# Altium project LCD_board.PrjPCB
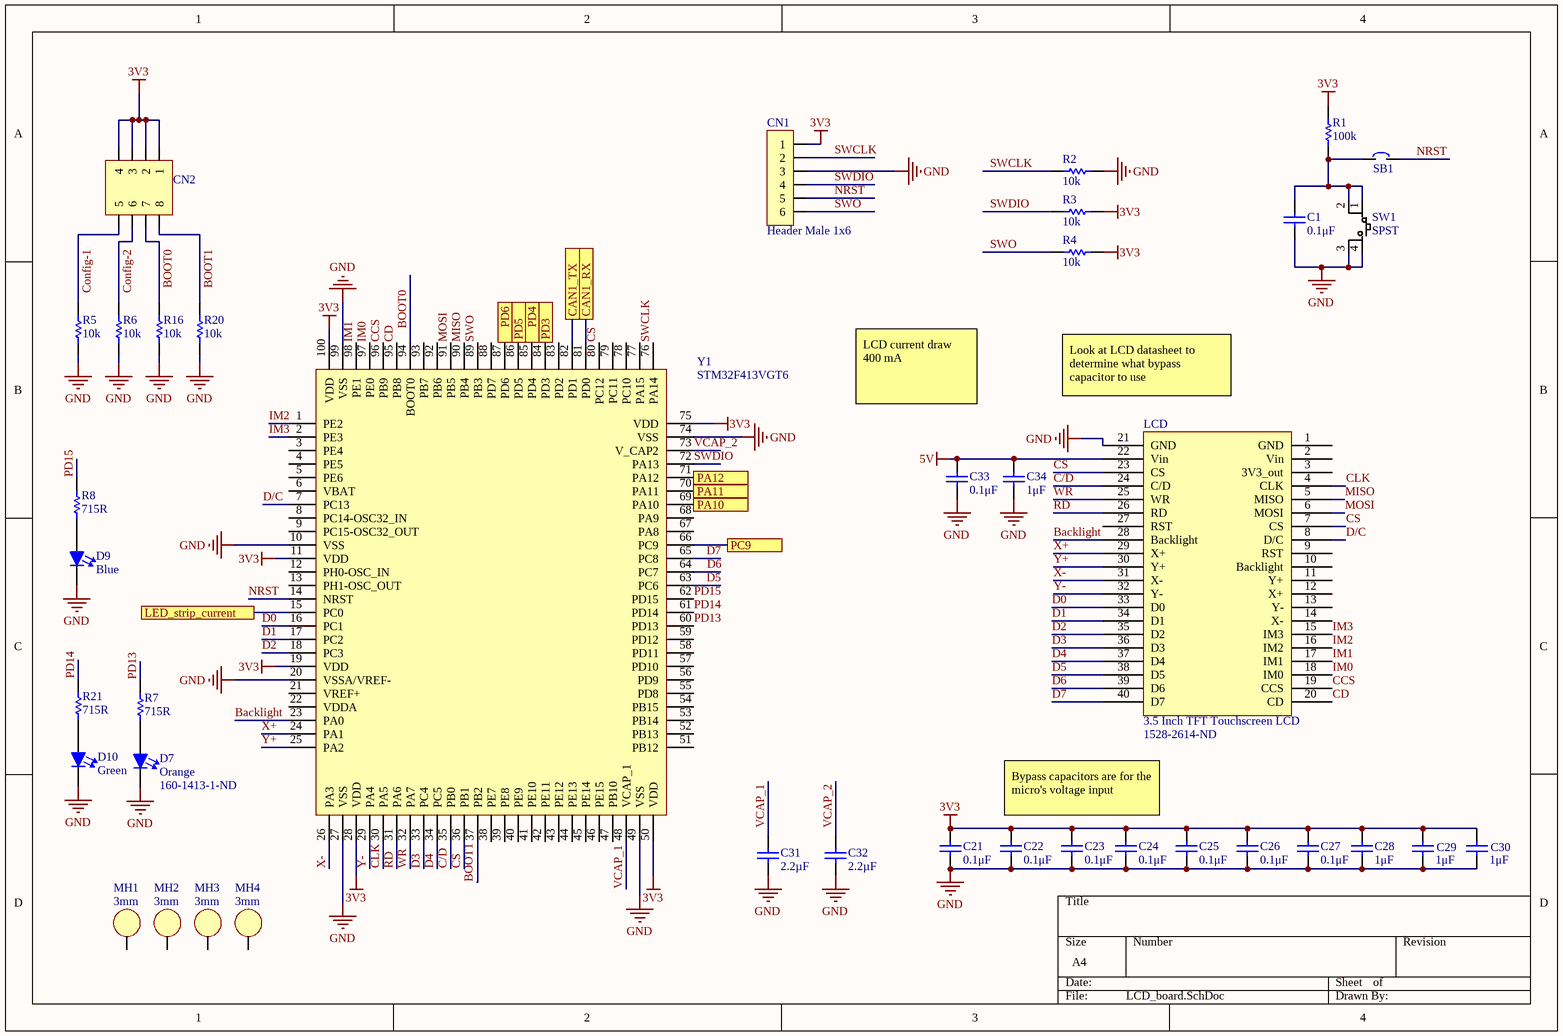
[diagram p0: LCD_board.SchDoc]
5 sheets, 101 parts. Net scope: flat (ports and power ports of the same name join across sheets).
Board file: lcd_board_1.PcbDoc
Sheets:
  LCD_board.SchDoc
  USB.SchDoc
  power.SchDoc
  LED strip.SchDoc
  CAN.SchDoc

## Sheet LCD_board.SchDoc
size A4

### Parts
C1  0.1μF  [CAPC1608N(0603")]
C21  0.1μF  [CAPC1608N(0603")]
C22  0.1μF  [CAPC1608N(0603")]
C23  0.1μF  [CAPC1608N(0603")]
C24  0.1μF  [CAPC1608N(0603")]
C25  0.1μF  [CAPC1608N(0603")]
C26  0.1μF  [CAPC1608N(0603")]
C27  0.1μF  [CAPC1608N(0603")]
C28  1μF  [CAPC1608N(0603")]
C29  1μF  [CAPC1608N(0603")]
C30  1μF  [CAPC1608N(0603")]
C31  2.2µF  [CAPC1608N(0603")]
C32  2.2µF  [CAPC1608N(0603")]
C33  0.1μF  [CAPC1608N(0603")]
C34  1μF  [CAPC1608N(0603")]
CN1  Header Male 1x6  [Header, Male, 1X6]
CN2  Header, Male, 2x4, Pitch: 0.1" (2.54mm), THT  [Header, Male, 2x4, Pitch: 0.1" (2.54mm),THT]  (value not drawn)
D7  Orange  Supplier Part Number 1: 160-1413-1-ND  [LED0805]
D9  Blue  [LED0805]
D10  Green  [LED0805]
LCD  3.5 Inch TFT Touchscreen LCD  Supplier Part Number 1: 1528-2614-ND  [LCD_touchscreen_tft]
MH1  3mm  [Mount-Hole_3mm]
MH2  3mm  [Mount-Hole_3mm]
MH3  3mm  [Mount-Hole_3mm]
MH4  3mm  [Mount-Hole_3mm]
R1  100k  [RESC1608N(0603")]
R2  10k  [RESC1608N(0603")]
R3  10k  [RESC1608N(0603")]
R4  10k  [RESC1608N(0603")]
R5  10k  [RESC1608N(0603")]
R6  10k  [RESC1608N(0603")]
R7  715R  [RESC1608N(0603")]
R8  715R  [RESC1608N(0603")]
R16  10k  [RESC1608N(0603")]
R20  10k  [RESC1608N(0603")]
R21  715R  [RESC1608N(0603")]
SB1  Solder Bridge  [Solder Bridge]  (value not drawn)
SW1  SPST  [4-SPST-NO]
Y1  STM32F413VGT6  [STM-LQFP100_M]

### Ports
CAN1_RX, CAN1_TX, LED_strip_current, PA10, PA11, PA12, PC9, PD3, PD4, PD5, PD6

### Nets
3V3: C21.2(Cathode) C22.2(Cathode) C23.2(Cathode) C24.2(Cathode) C25.2(Cathode) C26.2(Cathode) C27.2(Cathode) C28.2(Cathode) C29.2(Cathode) C30.2(Cathode) CN1.1 CN2.1 CN2.2 CN2.3 CN2.4 R1.2 R3.2 R4.2 Y1.11(VDD) Y1.19(VDD) Y1.28(VDD) Y1.50(VDD) Y1.75(VDD) Y1.100(VDD)
5V: C33.2(Cathode) C34.2(Cathode) LCD.22(Vin)
GND: C1.1(Anode) C21.1(Anode) C22.1(Anode) C23.1(Anode) C24.1(Anode) C25.1(Anode) C26.1(Anode) C27.1(Anode) C28.1(Anode) C29.1(Anode) C30.1(Anode) C31.1(Anode) C32.1(Anode) C33.1(Anode) C34.1(Anode) CN1.3 D7.1(Cathode) D9.1(Cathode) D10.1(Cathode) LCD.21(GND) R2.1 R5.1 R6.1 R16.1 R20.1 SW1.3 SW1.4 Y1.10(VSS) Y1.20(VSSA/VREF-) Y1.27(VSS) Y1.49(VSS) Y1.74(VSS) Y1.99(VSS)
Backlight: LCD.28(Backlight) Y1.23(PA0)
BOOT0: CN2.7 R16.2 Y1.94(BOOT0)
BOOT1: CN2.8 R20.2 Y1.37(PB2)
C/D: LCD.24(C/D) Y1.35(PB0)
CCS: LCD.19(CCS) Y1.96(PB9)
CD: LCD.20(CD) Y1.95(PB8)
CLK: LCD.4(CLK) Y1.30(PA5)
Config-1: CN2.5 R5.2
Config-2: CN2.6 R6.2
CS: LCD.7(CS) LCD.23(CS) Y1.36(PB1) Y1.80(PC12)
D0: LCD.33(D0) Y1.16(PC1)
D1: LCD.34(D1) Y1.17(PC2)
D2: LCD.35(D2) Y1.18(PC3)
D3: LCD.36(D3) Y1.33(PC4)
D4: LCD.37(D4) Y1.34(PC5)
D5: LCD.38(D5) Y1.63(PC6)
D6: LCD.39(D6) Y1.64(PC7)
D7: LCD.40(D7) Y1.65(PC8)
D/C: LCD.8(D/C) Y1.7(PC13)
IM0: LCD.18(IM0) Y1.97(PE0)
IM1: LCD.17(IM1) Y1.98(PE1)
IM2: LCD.16(IM2) Y1.1(PE2)
IM3: LCD.15(IM3) Y1.2(PE3)
MISO: LCD.5(MISO) Y1.90(PB4)
MOSI: LCD.6(MOSI) Y1.91(PB5)
NRST: CN1.5 SB1.2 Y1.14(NRST)
PD13: R7.2 Y1.60(PD13)
PD14: R21.2 Y1.61(PD14)
PD15: R8.2 Y1.62(PD15)
RD: LCD.26(RD) Y1.31(PA6)
SWCLK: CN1.2 R2.2 Y1.76(PA14)
SWDIO: CN1.4 R3.1 Y1.72(PA13)
SWO: CN1.6 R4.1 Y1.89(PB3)
USB_Data_N: Y1.70(PA11) ; port PA11
USB_Data_P: Y1.71(PA12) ; port PA12
VCAP_1: C31.2(Cathode) Y1.48(VCAP_1)
VCAP_2: C32.2(Cathode) Y1.73(V_CAP2)
WR: LCD.25(WR) Y1.32(PA7)
X+: LCD.29(X+) Y1.24(PA1)
X-: LCD.31(X-) Y1.26(PA3)
Y+: LCD.30(Y+) Y1.25(PA2)
Y-: LCD.32(Y-) Y1.29(PA4)
NetC1_2: C1.2(Cathode) R1.1 SB1.1 SW1.1 SW1.2
NetD7_2: D7.2(Anode) R7.1
NetD9_2: D9.2(Anode) R8.1
NetD10_2: D10.2(Anode) R21.1
NetP2_4: Y1.69(PA10) ; port PA10
NetR29_2: Y1.15(PC0) ; port LED_strip_current
NetU3_1: Y1.87(PD6) ; port PD6
NetU3_2: Y1.84(PD3) ; port PD3
NetU3_4: Y1.86(PD5) ; port PD5
NetU3_6: Y1.85(PD4) ; port PD4
NetU4_3: Y1.66(PC9) ; port PC9
NetU6_1: Y1.81(PD0) ; port CAN1_RX
NetU6_4: Y1.82(PD1) ; port CAN1_TX

Not connected (* = marked no-connect by the designer): LCD 1(GND) 2(Vin) 3(3V3_out) 9(RST) 10(Backlight) 11(Y+) 12(X+) 13(Y-) 14(X-) 27(RST); MH1 1; MH2 1; MH3 1; MH4 1; Y1 3(PE4) 4(PE5) 5(PE6) 6(VBAT) 8(PC14-OSC32_IN) 9(PC15-OSC32_OUT) 12(PH0-OSC_IN) 13(PH1-OSC_OUT) 21(VREF+) 22(VDDA) 38(PE7) 39(PE8) 40(PE9) 41(PE10) 42(PE11) 43(PE12) 44(PE13) 45(PE14) 46(PE15) 47(PB10) 51(PB12) 52(PB13) 53(PB14) 54(PB15) 55(PD8) 56(PD9) 57(PD10) 58(PD11) 59(PD12) 67(PA8) 68(PA9) 77(PA15) 78(PC10) 79(PC11) 83(PD2) 88(PD7) 92(PB6) 93(PB7)

### Notes on the sheet
- LCD current draw 400 mA
- (near LCD) Look at LCD datasheet to determine what bypass capacitor to use
- Bypass capacitors are for the micro's voltage input

### Library data of the parts
C1 C21-C27 C33 = 0.1uF 100V 0603 SMD, Ceramic: Capacitor, Ceramic, 100V, +/- 10%, 0603 SMD, X7R; MFG: TDK; MFG#: CGA3E3X7S2A104K080AB; Published: 16-04-26; Publisher: AUVic; PackageDescription: Chip Capacitor; Value: 0.1μF; Created By: Ashwin Sira; Supplier 1: Digi-Key; Supplier Part Number 1: 445-6938-1-ND
C28-C30 C34 = 1uF 25V 0603 SMD, Ceramic: Capacitor, Ceramic, 25V, +/- 10%, 0603 SMD, X5R; MFG: Murata-Electronics-North-America; MFG#: GRM188R61E105KA12D; Published: 16-06-27; Publisher: AUVic; PackageDescription: Chip Capacitor; Value: 1μF; Created By: Andy Bates; Supplier 1: Digi-Key; Supplier Part Number 1: 490-3897-1-ND
C31 C32 = 2.2uF, 50V, 0603 SMD, X5R, Ceramic: Capacitor, Ceramic, 50V, 10%, 0603 SMD, X5R; Date Created: *; PackageDescription: Chip Capacitor; Value: 2.2µF; Made By: *; Publisher: AUVic; Supplier 1: Digi-Key; Supplier Part Number 1: 490-10733-1-ND
CN1 = Header, Male, 1x6: 1x6, Pads Pitch: 0.1" (2.54mm), Through hole; Made Bates: Andy Bates; Supplier 1: Digikey; Supplier 1 Part Number: 952-2270-ND
D7 = LED, 0805 (2012), Orange, Clear: Colour: Orange; Created By: Robert Keen; ComponentLink1Description: Digikey; ComponentLink1URL: https://www.digikey.ca/product-detail/en/lite-on-inc/LTST-C170KFKT/160-1413-1-ND/386774; Supplier 1: Digi-Key
D9 = LED, 0805 (2012), Blue, Clear: Colour: Red; Created By: Ashwin Sira; Supplier 1: Digi-Key; Supplier Part Number 1: 732-4982-1-ND
D10 = LED, 0805 (2012), Green, Clear: Colour: Green; Created By: Andy Bates; Supplier 1: Digi-Key; Supplier Part Number 1: 475-1410-1-ND
LCD = Adafruit ILI9341: 3.2" TFT LCD with Touchscreen Breakout Board w/MicroSD Socket; ComponentLink1Description: Adafruit; ComponentLink1URL: https://www.adafruit.com/product/1743; ComponentLink2Description: Datasheet; ComponentLink2URL: https://cdn-shop.adafruit.com/datasheets/ILI9341.pdf; ComponentLink3Description: Raw LCD Datasheet; ComponentLink3URL: https://cdn-shop.adafruit.com/datasheets/MI0283QT-11+V1.1.PDF; ComponentLink4Description: DigiKey; ComponentLink4URL: https://www.digikey.ca/products/en/optoelectronics/display-modules-lcd-oled-graphic/107?k=&pkeyword=&pv652=165&FV=ffe0006b%2Cfffc05f8&quantity=0&ColumnSort=0&page=1&pageSize=25; ComponentLink5Description: Adafruit Guide; ComponentLink5URL: https://cdn-learn.adafruit.com/downloads/pdf/adafruit-2-dot-8-color-tft-touchscreen-breakout-v2.pdf; Supplier 1: Digi-Key; Supplier 2: Digi-Key; Supplier Part Number 2: S7053-ND
MH1-MH4 = Mount_Hole_3mm
R1 = 100kR, 1%, 1/10W, 0603 SMD: Made By: Andy Bates; Owned By: AUVic; Created On: 14-06-30; Last Edited: 14-06-30; Value: 100k; Supplier 1: Digi-Key; Supplier Part Number 1: 311-100KGRCT-ND
R2-R6 R16 R20 = 10kR, 1%, 1/10W, 0603 SMD: Made By: Ashwin Sira; Owned By: AUVic; Created On: 14-05-31; Last Edited: 14-05-31; Supplier 1: Digi-Key; Supplier Part Number 1: 311-10.0KHRCT-ND; Value: 10k
R7 R8 R21 = 715R, 1%, 1/10W, 0603, SMD: Created By: Ashwin Sira; Publisher: AUVic; Date Created: 2016-06-10; Value: 715R; Supplier 1: Digi-Key; Supplier Part Number 1: 541-715HCT-ND
SB1 = Solder Bridge: Made By: Andy Bates; Created On: 2016/09/08
SW1 = 4 pin Tacitle Switch: Made By: Andy Bates; Button Type: Single Pole Single Throw; Supplier 1: Digikey; Supplier 1 Part Number: CKN9084CT-ND
Y1 = STM32F413VGT6: ARM Cortex-M4 32-bit MCU, 180 MHz, 320 KB Internal Rap, 81 I/O, 100-pin LQFP, -40 to 85 degC, Tray; Core Size: 32-bit; Supplier 1: Digi-Key; Supplier: Digikey; Supplier Part Number 1: 497-17009-ND
CN2 = Header, Male, 2x4, Pitch: 0.1" (2.54mm), THT: Publisher: AUVic; Date Published: 2017-09-13; Last Updated: *; Reviewed By: *; Created By: Andy Bates

## Sheet USB.SchDoc
size A4
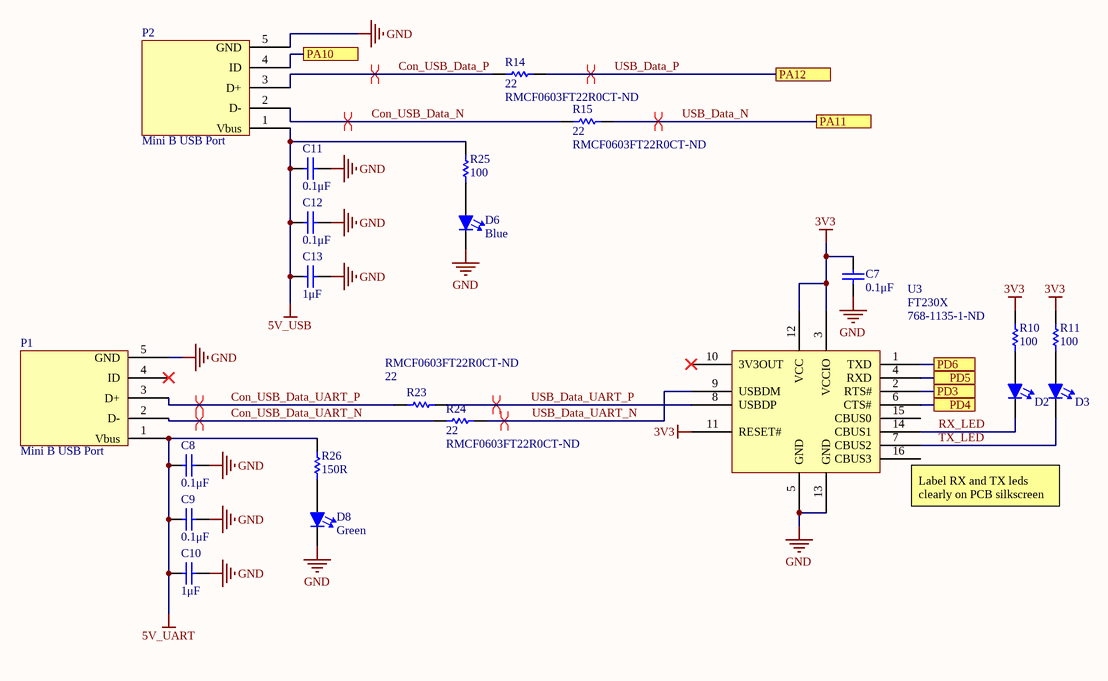
[diagram p1: USB.SchDoc]

### Parts
C7  0.1μF  [CAPC1608N(0603")]
C8  0.1μF  [CAPC1608N(0603")]
C9  0.1μF  [CAPC1608N(0603")]
C10  1μF  [CAPC1608N(0603")]
C11  0.1μF  [CAPC1608N(0603")]
C12  0.1μF  [CAPC1608N(0603")]
C13  1μF  [CAPC1608N(0603")]
D2  Red  [LED0805]  (value not drawn)
D3  Red  [LED0805]  (value not drawn)
D6  Blue  [LED0805]
D8  Green  [LED0805]
P1  Mini B USB Port  [Mini B USB Footprint]
P2  Mini B USB Port  [Mini B USB Footprint]
R10  100  [RESC1608N(0603")]
R11  100  [RESC1608N(0603")]
R14  22  Supplier Part Number 1: RMCF0603FT22R0CT-ND  [RESC1608N(0603")]
R15  22  Supplier Part Number 1: RMCF0603FT22R0CT-ND  [RESC1608N(0603")]
R23  22  Supplier Part Number 1: RMCF0603FT22R0CT-ND  [RESC1608N(0603")]
R24  22  Supplier Part Number 1: RMCF0603FT22R0CT-ND  [RESC1608N(0603")]
R25  100  [RESC1608N(0603")]
R26  150R  [RESC1608N(0603")]
U3  FT230X  Supplier Part Number 1: 768-1135-1-ND  [SSOP16]

### Ports
PA10, PA11, PA12, PD3, PD4, PD5, PD6

### Nets
3V3: C7.2(Cathode) R10.2 R11.2 U3.3(VCCIO) U3.11(RESET#) U3.12(VCC)
5V_UART: C8.2(Cathode) C9.2(Cathode) C10.2(Cathode) P1.1(Vbus) R26.2
5V_USB: C11.2(Cathode) C12.2(Cathode) C13.2(Cathode) P2.1(Vbus) R25.2
GND: C7.1(Anode) C8.1(Anode) C9.1(Anode) C10.1(Anode) C11.1(Anode) C12.1(Anode) C13.1(Anode) D6.1(Cathode) D8.1(Cathode) P1.5(GND) P2.5(GND) U3.5(GND) U3.13(GND)
Con_USB_Data_N: P2.2(D-) R15.1
Con_USB_Data_P: P2.3(D+) R14.1
Con_USB_Data_UART_N: P1.2(D-) R24.1
Con_USB_Data_UART_P: P1.3(D+) R23.1
RX_LED: D2.1(Cathode) U3.14(CBUS1)
TX_LED: D3.1(Cathode) U3.7(CBUS2)
USB_Data_N: R15.2 ; port PA11
USB_Data_P: R14.2 ; port PA12
USB_Data_UART_N: R24.2 U3.9(USBDM)
USB_Data_UART_P: R23.2 U3.8(USBDP)
NetD2_2: D2.2(Anode) R10.1
NetD3_2: D3.2(Anode) R11.1
NetD6_2: D6.2(Anode) R25.1
NetD8_2: D8.2(Anode) R26.1
NetP2_4: P2.4(ID) ; port PA10
NetU3_1: U3.1(TXD) ; port PD6
NetU3_2: U3.2(RTS#) ; port PD3
NetU3_4: U3.4(RXD) ; port PD5
NetU3_6: U3.6(CTS#) ; port PD4

Not connected (* = marked no-connect by the designer): P1 4(ID)*; U3 10(3V3OUT)* 15(CBUS0) 16(CBUS3)

### Layout directives
differential pair: Con_USB_Data_N, Con_USB_Data_P, Con_USB_Data_UART_N, Con_USB_Data_UART_P, USB_Data_N, USB_Data_P, USB_Data_UART_N, USB_Data_UART_P

### Notes on the sheet
- (near U3) Label RX and TX leds clearly on PCB silkscreen

### Library data of the parts
C7-C9 C11 C12 = 0.1uF 100V 0603 SMD, Ceramic: as C1 on sheet LCD_board; Published: 16-04-26; Publisher: AUVic; PackageDescription: Chip Capacitor; Value: 0.1μF; Created By: Ashwin Sira; Supplier 1: Digi-Key; Supplier Part Number 1: 445-6938-1-ND
C10 C13 = 1uF 25V 0603 SMD, Ceramic: as C28 on sheet LCD_board; Published: 16-06-27; Publisher: AUVic; PackageDescription: Chip Capacitor; Value: 1μF; Created By: Andy Bates; Supplier 1: Digi-Key; Supplier Part Number 1: 490-3897-1-ND
D2 D3 = LED, 0805 (2012), Red, Clear: Supplier 1: Digi-Key; Supplier Part Number 1: 732-4984-1-ND; Colour: Red; Created By: Ashwin Sira
D6 = LED, 0805 (2012), Blue, Clear: Colour: Red; Created By: Ashwin Sira; Supplier 1: Digi-Key; Supplier Part Number 1: 732-4982-1-ND
D8 = LED, 0805 (2012), Green, Clear: Colour: Green; Created By: Andy Bates; Supplier 1: Digi-Key; Supplier Part Number 1: 475-1410-1-ND
P1 P2 = Mini B USB Port: Mini B USB Port - Female; Created by: Gabriel Green; Created on: July 5, 2017; Supplier 1: Digi-Key; Supplier Part Number 1: 151-1206-1-ND
R10 R11 R25 = 100R, 1%, 1/10W, 0603 SMD: Made By: Andy Bates; Owned By: AUVic; Created On: 16-09-10; Last Edited: 16-09-10; Value: 100; Supplier 1: Digi-Key; Supplier Part Number 1: 311-100HRCT-ND
R14 R15 R23 R24 = 22 Ohm, 1%, 1/10W , 0603, SMD: Created By: Robert Keen; Publisher: AUVic; Date Created: 2018-07-17; Value: 22; ComponentLink1Description: Digikey; ComponentLink1URL: https://www.digikey.ca/product-detail/en/stackpole-electronics-inc/RMCF0603FT22R0/RMCF0603FT22R0CT-ND/1942946; Supplier 1: Digi-Key
R26 = 150R, 1%, 1/10W, 0603, SMD: RES SMD 150 OHM 1% 1/10W 0603; Created By: Robert Keen; Publisher: AUVic; Date Created: 2018-08-15; Value: 150R; Supplier 1: Digi-Key; Supplier Part Number 1: P150HCT-ND; ComponentLink1Description: Digikey; ComponentLink1URL: https://www.digikey.ca/product-detail/en/panasonic-electronic-components/ERJ-3EKF1500V/P150HCT-ND/198177
U3 = FTDI - USB to UART: Supplier 1: Digi-Key; Created by: Gabriel Green; Created on: July 5th, 2017

## Sheet power.SchDoc
size A4
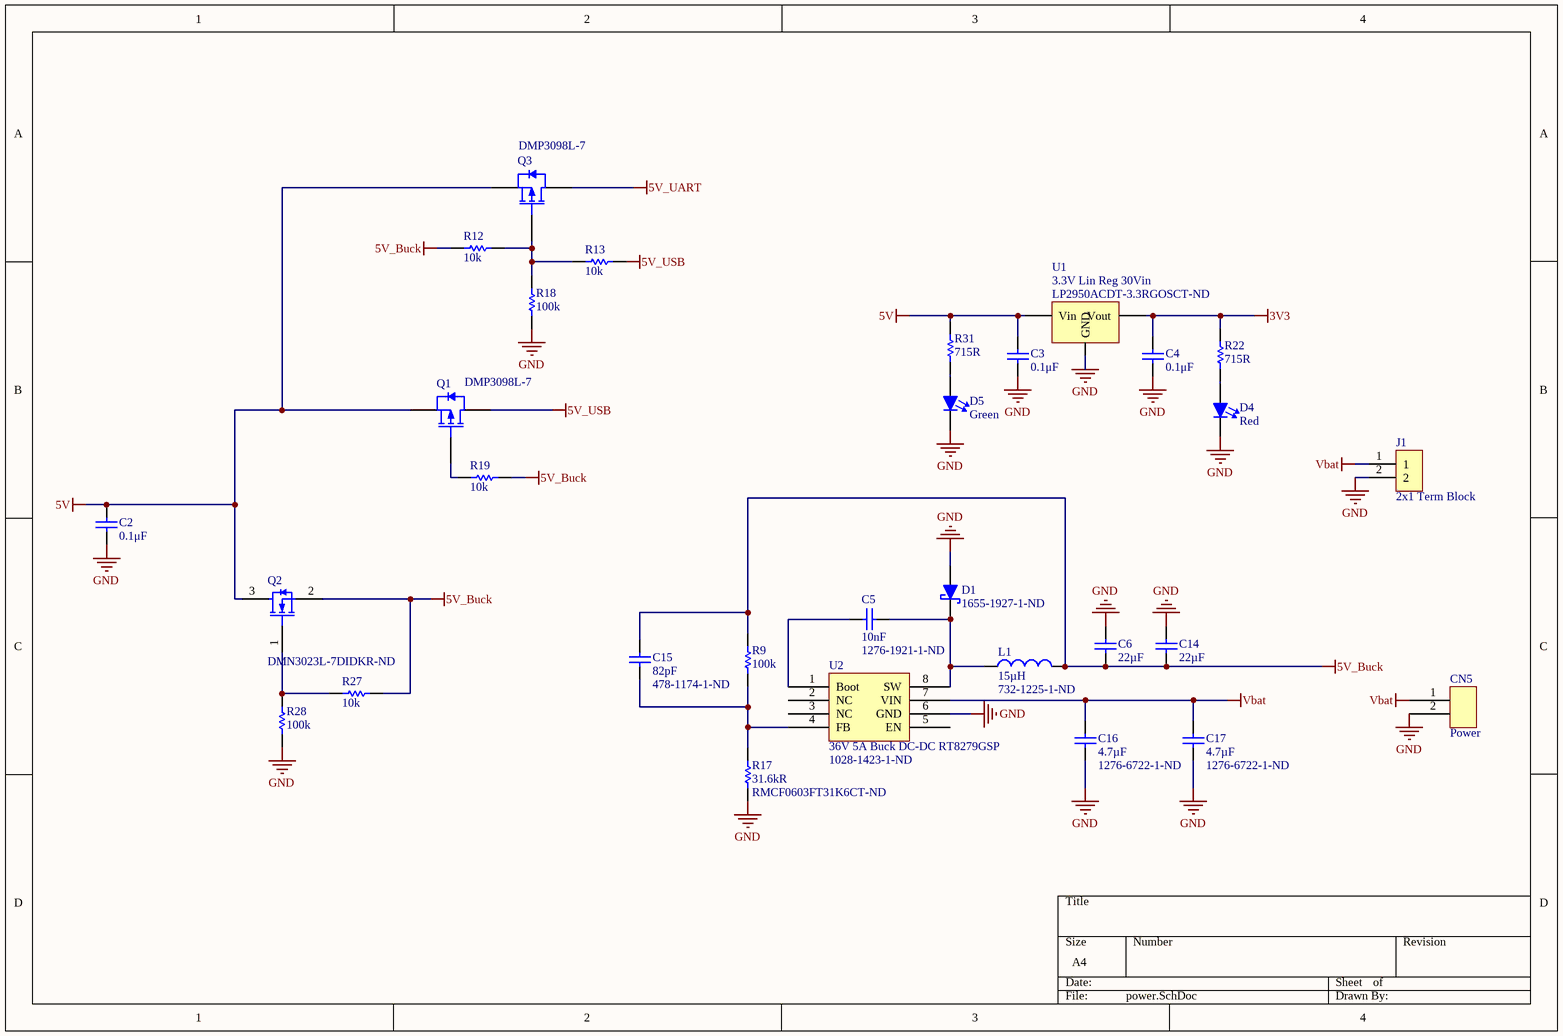
[diagram p2: power.SchDoc]

### Parts
C2  0.1μF  [CAPC1608N(0603")]
C3  0.1μF  [CAPC1608N(0603")]
C4  0.1μF  [CAPC1608N(0603")]
C5  10nF  Supplier Part Number 1: 1276-1921-1-ND  [CAPC1608N(0603")]
C6  22µF  [CAPC2012N(0805")]
C14  22µF  [CAPC2012N(0805")]
C15  82pF  Supplier Part Number 1: 478-1174-1-ND  [CAPC1608N(0603")]
C16  4.7µF  Supplier Part Number 1: 1276-6722-1-ND  [CAPC2012N(0805")]
C17  4.7µF  Supplier Part Number 1: 1276-6722-1-ND  [CAPC2012N(0805")]
CN5  Power  [2X1 Power Connector 90 degrees]
D1  Supplier Part Number 1: 1655-1927-1-ND  [SOD-123F]  (hidden comment: DSS14UTR)
D4  Red  [LED0805]
D5  Green  [LED0805]
J1  2x1 Term Block  [2X1 Terminal Blocks]
L1  15µH  Supplier Part Number 1: 732-1225-1-ND  [WE-PD-XL]
Q1  DMP3098L-7  [DIOD-SOT23-3_V]
Q2  Supplier Part Number 1: DMN3023L-7DIDKR-ND  [SOT-23]  (hidden comment: MOSFET N-Channel, 30V, 6.2A,)
Q3  DMP3098L-7  [DIOD-SOT23-3_V]
R9  100k  [RESC1608N(0603")]
R12  10k  [RESC1608N(0603")]
R13  10k  [RESC1608N(0603")]
R17  31.6kR  Supplier Part Number 1: RMCF0603FT31K6CT-ND  [RESC1608N(0603")]
R18  100k  [RESC1608N(0603")]
R19  10k  [RESC1608N(0603")]
R22  715R  [RESC1608N(0603")]
R27  10k  [RESC1608N(0603")]
R28  100k  [RESC1608N(0603")]
R31  715R  [RESC1608N(0603")]
U1  3.3V Lin Reg 30Vin  Supplier Part Number 1: LP2950ACDT-3.3RGOSCT-ND  [T0-252]
U2  36V 5A Buck DC-DC RT8279GSP  Supplier Part Number 3: 1028-1423-1-ND  [8-SOP-EP]

### Nets
3V3: C4.2(Cathode) R22.2 U1.3(Vout)
5V: C2.2(Cathode) C3.2(Cathode) Q1.2(S) Q2.3(Drain) Q3.2(S) R31.2 U1.2(Vin)
5V_Buck: C6.1(Anode) C14.1(Anode) C15.2 L1.2 Q2.2(Source) R9.2 R12.1 R19.2 R27.2
5V_UART: Q3.3(D)
5V_USB: Q1.3(D) R13.2
GND: C2.1(Anode) C3.1(Anode) C4.1(Anode) C6.2(Cathode) C14.2(Cathode) C16.2(Cathode) C17.2(Cathode) CN5.2 D1.A(Anode) D4.1(Cathode) D5.1(Cathode) J1.2 R17.1 R18.1 R28.1 U1.1(GND) U2.6(GND)
Vbat: C16.1(Anode) C17.1(Anode) CN5.1 J1.1 U2.7(VIN)
NetC5_1: C5.1(Anode) D1.K(Cathode) L1.1 U2.8(SW)
NetC5_2: C5.2(Cathode) U2.1(Boot)
NetC15_1: C15.1 R9.1 R17.2 U2.4(FB)
NetD4_2: D4.2(Anode) R22.1
NetD5_2: D5.2(Anode) R31.1
NetQ1_1: Q1.1(G) R19.1
NetQ2_1: Q2.1(Gate) R27.1 R28.2
NetQ3_1: Q3.1(G) R12.2 R13.1 R18.2

Not connected (* = marked no-connect by the designer): U2 2(NC) 3(NC) 5(EN)

### Library data of the parts
C2-C4 = 0.1uF 100V 0603 SMD, Ceramic: as C1 on sheet LCD_board; Published: 16-04-26; Publisher: AUVic; PackageDescription: Chip Capacitor; Value: 0.1μF; Created By: Ashwin Sira; Supplier 1: Digi-Key; Supplier Part Number 1: 445-6938-1-ND
C5 = 10 nF, 50V 0603 SMD, Ceramic: Capacitor, Ceramic, 50V, +/- 10%, 0603 SMD; MFG: Samsung; MFG#: GRM188R61A475KE15D; Published: 16-06-23; Publisher: AUVic; PackageDescription: Chip Capacitor; Value: 10nF; Created By: Gabriel; Supplier 1: Digi-Key
C6 C14 = 22uF 35V 0805 SMD, Ceramic: Capacitor, Ceramic, 35V, +/- 20%, 0805 SMD, X5R; Published: 14-06-01; Publisher: AUVic; PackageDescription: Chip Capacitor; Value: 22µF; Supplier 1: Digi-Key; Supplier Part Number 1: 445-14428-1-ND
C15 = 82pF 50V 0603 SMD, Ceramic: 82pF 50V Ceramic Capacitor C0G, NP0 0603; Value: 82pF; Created By: Robert Keen; Created On: 2018-07-18; ComponentLink1Description: Digikey; ComponentLink1URL: https://www.digikey.ca/product-detail/en/avx-corporation/06035A820JAT2A/478-1174-1-ND/564206; Supplier 1: Digi-Key
C16 C17 = 4.7uF 35V 0805 SMD, Ceramic: Capacitor, Ceramic, 35V, +/- 10%, 0805 SMD, X5R; Made By: Andy Bates; Published: 16-11-12; Publisher: AUVic; PackageDescription: Chip Capacitor; Value: 4.7µF; Supplier 1: Digi-Key
CN5 = 2x1, Male header, Right Angle, Latch holder: Connector Header Through Hole, Right Angle 2 position 0.312" (7.92mm); Made by: Robert Keen; ComponentLink1Description: Digikey (male); ComponentLink1URL: https://www.digikey.ca/product-detail/en/hirose-electric-co-ltd/DF22R-2P-7.92DS-05/H10706-ND/1025057; ComponentLink2Description: Digikey (female); ComponentLink2URL: https://www.digikey.ca/product-detail/en/hirose-electric-co-ltd/DF22R-2S-7.92C-28/H1615-ND/510248; ComponentLink3Description: Digikey (crimp); ComponentLink3URL: https://www.digikey.ca/product-detail/en/hirose-electric-co-ltd/DF22-1416SCF/H2788CT-ND/365031; Made on: 2018-08-16; Supplier 3: Digi-Key; Supplier Part Number 1: H10706-ND; Supplier Part Number 2: H1615-ND; Supplier Part Number 3: H2788CT-ND; Supplier 2: Digi-Key; Supplier 1: Digi-Key
D1 = DSS14UTR: Diode, Schottky, 40V, 1A; Created By: Robert Keen; Publisher: AUVic; Date Created: 2018-07-11; ComponentLink1Description: Digikey; ComponentLink1URL: https://www.digikey.ca/product-detail/en/smc-diode-solutions/DSS14UTR/1655-1927-1-ND/8341869; Supplier 1: Digi-Key
D4 = LED, 0805 (2012), Red, Clear: Supplier 1: Digi-Key; Supplier Part Number 1: 732-4984-1-ND; Colour: Red; Created By: Ashwin Sira
D5 = LED, 0805 (2012), Green, Clear: Colour: Green; Created By: Andy Bates; Supplier 1: Digi-Key; Supplier Part Number 1: 475-1410-1-ND
J1 = 2x1 Terminal Block: Made by: Andy Bates; Supplier 1: Digikey; Supplier Part Number 1: ED2740-ND
L1 = 15µH 5A Inductor: 15µH Shielded Wirewound Inductor 5A 27 mOhm Max Nonstandard; Created By: Robert Keen; Created On: 2018-06-13; Value: 15µH; ComponentLink1Description: Digikey; ComponentLink1URL: https://www.digikey.ca/product-detail/en/wurth-electronics-inc/744770115/732-1225-1-ND/1639286; Supplier 1: Digi-Key
Q1 Q3 = CMP-0697-00001-2: P-Channel Enhancement Mode MOSFET, -30 V VDS, -55 to 155 degC, 3-Pin SOT23, RoHS, Tape and Reel; Manufacturer: Diodes Inc; PD (TA: 25 degC)=1.08 W; VGS: +/- 20 V; VDS: -30 V; IDS (TA: 25 degC)=-3.8 A; RDS(on) (Max.) (VGS: 4.5 V)=120 mOhm; VGS(th) (Max.): -2.1 V; ComponentLink3Description: Package Specification; ComponentLink3URL: http://www.diodes.com/datasheets/ap02002.pdf; PackageDescription: 3-Pin Small Outline Transistor, Body 1.3 x 2.9 mm, Pitch 0.95 mm; PackageReference: SOT23; PartNumber: DMP3098L-7; ComponentLink1Description: Manufacturer URL; ComponentLink2Description: Datasheet; ComponentLink2URL: http://www.diodes.com/datasheets/ds31447.pdf; ComponentLink1URL: http://www.diodes.com/; DatasheetVersion: Rev. 8 - 2; Mounting Technology: Surface Mount; RoHS: TRUE; Packing: Tape and Reel; PackageVersion: Rev. 75; Operating Temperature Range: -55 to 150 degC
Q2 = MOSFET N-Channel, 30V, 6.2A,: N-Channel 30V 6.2A (Ta) 900mW (Ta) Surface Mount SOT-23; Supplier 1: Digi-Key; Created By: Poorna Chander Kalidas; ComponentLink1Description: Digi-Key; ComponentLink1URL: https://www.digikey.ca/product-detail/en/diodes-incorporated/DMN3023L-7/DMN3023L-7DICT-ND/5453155
R9 R18 R28 = 100kR, 1%, 1/10W, 0603 SMD: Made By: Andy Bates; Owned By: AUVic; Created On: 14-06-30; Last Edited: 14-06-30; Value: 100k; Supplier 1: Digi-Key; Supplier Part Number 1: 311-100KGRCT-ND
R12 R13 R19 R27 = 10kR, 1%, 1/10W, 0603 SMD: Made By: Ashwin Sira; Owned By: AUVic; Created On: 14-05-31; Last Edited: 14-05-31; Supplier 1: Digi-Key; Supplier Part Number 1: 311-10.0KHRCT-ND; Value: 10k
R17 = 31.6kR, 1%, 1/10W, 0603, SMD: Created By: Robert Keen; Date Created: 2018-07-18; Value: 31.6kR; ComponentLink1Description: Digikey; ComponentLink1URL: https://www.digikey.ca/product-detail/en/stackpole-electronics-inc/RMCF0603FT31K6/RMCF0603FT31K6CT-ND/1943089; Supplier 1: Digi-Key
R22 R31 = 715R, 1%, 1/10W, 0603, SMD: Created By: Ashwin Sira; Publisher: AUVic; Date Created: 2016-06-10; Value: 715R; Supplier 1: Digi-Key; Supplier Part Number 1: 541-715HCT-ND
U1 = 3.3V TO-252 Linear Regulator: Supplier 1: Digi-Key
U2 = 36V 5A Buck DC-DC RT8279GSP: Made by: Robert Keen; Supplier 1: Digi-Key; Made on: 2017-07-18; Supplier 2: Digi-Key; ComponentLink1Description: Digikey; ComponentLink1URL: https://www.digikey.ca/product-detail/en/richtek-usa-inc/RT8279GSP/1028-1423-1-ND/5880353; Supplier 3: Digi-Key

## Sheet LED strip.SchDoc
size A4
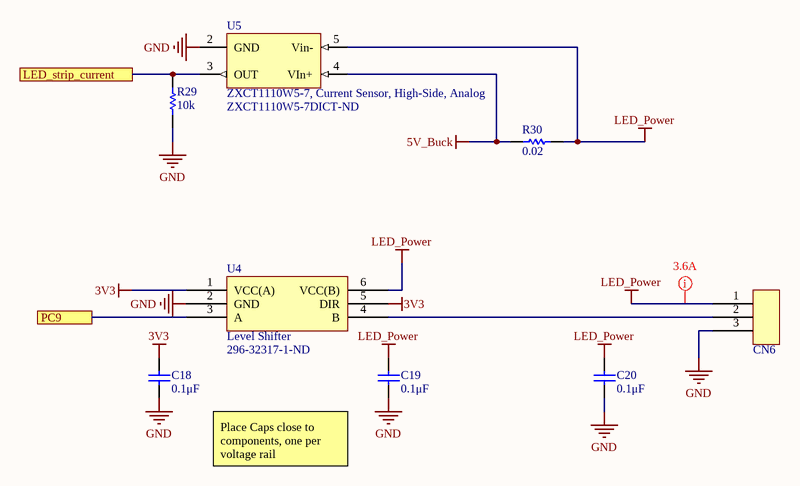
[diagram p3: LED strip.SchDoc]

### Parts
C18  0.1μF  [CAPC1608N(0603")]
C19  0.1μF  [CAPC1608N(0603")]
C20  0.1μF  [CAPC1608N(0603")]
CN6  B3PS-VH(LF)(SN)  [3X1 Male Header, Locking, 10A]  (value not drawn)
R29  10k  [RESC1608N(0603")]
R30  0.02  [RESC6332N(2512")]
U4  Level Shifter  Supplier Part Number 1: 296-32317-1-ND  [SOT-363]
U5  ZXCT1110W5-7, Current Sensor, High-Side, Analog  Supplier Part Number 1: ZXCT1110W5-7DICT-ND  [SOT23-5]

### Ports
LED_strip_current, PC9

### Nets
3V3: C18.1(Anode) U4.1(VCC(A)) U4.5(DIR)
5V_Buck: R30.1 U5.4(VIn+)
GND: C18.2(Cathode) C19.2(Cathode) C20.2(Cathode) CN6.3 R29.1 U4.2(GND) U5.2(GND)
LED_Power: C19.1(Anode) C20.1(Anode) CN6.1 R30.2 U4.6(VCC(B)) U5.5(Vin-)
NetCN6_2: CN6.2 U4.4(B)
NetR29_2: R29.2 U5.3(OUT) ; port LED_strip_current
NetU4_3: U4.3(A) ; port PC9

### Layout directives
mark named 3.6A: LED_Power

### Notes on the sheet
- Place Caps close to components, one per voltage rail

### Library data of the parts
C18-C20 = 0.1uF 16V 0603 SMD, Ceramic: Capacitor, Ceramic, 16V, +/- 10%, 0603 SMD, X7R; Published: 16-04-26; Publisher: AUVic; PackageDescription: Chip Capacitor; Value: 0.1μF; Created By: Andy Bates; Supplier 1: Digi-Key; Supplier Part Number 1: 1276-1005-1-ND
CN6 = 3x1 Male Header, Locking, 10A: CONN HEADER VH SIDE 3POS 3.96MM; Made by: Robert Keen; Made on: 2018-08-16; Supplier 1: Digi-Key; Supplier Part Number 1: 455-1649-ND; ComponentLink1Description: Digikey (male); ComponentLink1URL: https://www.digikey.ca/product-detail/en/jst-sales-america-inc/B3PS-VH-LF-SN/455-1649-ND/926556; ComponentLink2Description: Digikey (female); ComponentLink2URL: https://www.digikey.ca/product-detail/en/jst-sales-america-inc/VHR-3N/455-1184-ND/608625; ComponentLink3Description: Digikey (crimps); ComponentLink3URL: https://www.digikey.ca/product-detail/en/jst-sales-america-inc/SVH-21T-P1.1/455-1133-1-ND/527367; Supplier Part Number 2: 455-1184-ND; Supplier Part Number 3: 455-1133-1-ND
R29 = 10kR, 1%, 1/10W, 0603 SMD: Made By: Ashwin Sira; Owned By: AUVic; Created On: 14-05-31; Last Edited: 14-05-31; Supplier 1: Digi-Key; Supplier Part Number 1: 311-10.0KHRCT-ND; Value: 10k
R30 = 0R02, 1%, 2W, 2512 SMD: Created By: Robert Keen; Created On: 2018-08-16; ComponentLink1Description: Digikey; ComponentLink1URL: https://www.digikey.ca/product-detail/en/te-connectivity-passive-product/RLP73V3AR020FTDF/A109677CT-ND/4032443; Supplier 1: Digi-Key; Supplier Part Number 1: A109677CT-ND; Value: 0.02
U4 = Bidirectional Level Shifter, 1.65V - 5.5V VCCA, 1.65V - 5.5V VCCB: Voltage Level Translator Bidirectional 1 Circuit 1 Channel 420Mbps SC-88 (SOT-363); Made By: Andy Bates; Made on: 2018-08-16; ComponentLink1Description: Digikey; ComponentLink1URL: https://www.digikey.ca/product-detail/en/nxp-usa-inc/NTB0101AGWH/568-14541-1-ND/9449849; Supplier 1: Digi-Key
U5 = ZXCT1110W5-7, Current Sensor, High-Side, Analog: Diodes Incorporated, ZXCT1110W5-7; Created By: Jacob Lower; Publisher: AUVic; Created On: 2016-03-16; Supplier 1: Digi-Key

## Sheet CAN.SchDoc
size A4
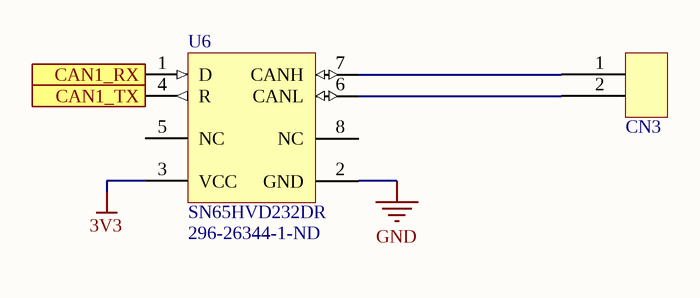
[diagram p4: CAN.SchDoc]

### Parts
CN3  640456-2  [640456-2]  (value not drawn)
U6  SN65HVD232DR  Supplier Part Number 1: 296-26344-1-ND  [8-SOIC]

### Ports
CAN1_RX, CAN1_TX

### Nets
3V3: U6.3(VCC)
GND: U6.2(GND)
NetCN3_1: CN3.1 U6.7(CANH)
NetCN3_2: CN3.2 U6.6(CANL)
NetU6_1: U6.1(D) ; port CAN1_RX
NetU6_4: U6.4(R) ; port CAN1_TX

Not connected (* = marked no-connect by the designer): U6 5(NC) 8(NC)

### Library data of the parts
CN3 = 2x1 Male Header, Friction Lock: CONN HEADER VERT 2POS .100 TIN; Made by: Robert Keen; ComponentLink1Description: Digikey; ComponentLink1URL: https://www.digikey.ca/product-detail/en/te-connectivity-amp-connectors/640456-2/A1921-ND/109003; Made on: 2018-08-15; Supplier 1: Digi-Key; Supplier Part Number 1: A1921-ND
U6 = CAN Half Duplex SN65HVD232DR: IC CAN TRANSCEIVER 3.3V 8-SOIC; Made by: Robert Keen; ComponentLink1Description: Digikey; ComponentLink1URL: https://www.digikey.ca/product-detail/en/texas-instruments/SN65HVD232DR/296-26344-1-ND/2254978; Supplier 1: Digi-Key; Made on: 2018-08-14

## Nets that join several sheets
3V3: LCD_board (24 pins), USB (6 pins), power (C4.2 R22.2 U1.3), LED strip (C18.1 U4.1 U4.5), CAN (U6.3)
5V: LCD_board (C33.2 C34.2 LCD.22), power (7 pins)
5V_Buck: power (9 pins), LED strip (R30.1 U5.4)
5V_UART: USB (5 pins), power (Q3.3)
5V_USB: USB (5 pins), power (Q1.3 R13.2)
GND: LCD_board (33 pins), USB (13 pins), power (17 pins), LED strip (7 pins), CAN (U6.2)
NetP2_4: LCD_board (Y1.69), USB (P2.4)
NetR29_2: LCD_board (Y1.15), LED strip (R29.2 U5.3)
NetU3_1: LCD_board (Y1.87), USB (U3.1)
NetU3_2: LCD_board (Y1.84), USB (U3.2)
NetU3_4: LCD_board (Y1.86), USB (U3.4)
NetU3_6: LCD_board (Y1.85), USB (U3.6)
NetU4_3: LCD_board (Y1.66), LED strip (U4.3)
NetU6_1: LCD_board (Y1.81), CAN (U6.1)
NetU6_4: LCD_board (Y1.82), CAN (U6.4)
USB_Data_N: LCD_board (Y1.70), USB (R15.2)
USB_Data_P: LCD_board (Y1.71), USB (R14.2)